# Altium schematic sheet SFP.schdoc: TEBF0808 - SFP
size A4; DocumentNumber: TEBF0808; Revision: 04; SheetNumber: 9; SheetTotal: 36; Date: 2016-09-29; CompanyName: Trenz Electronic GmbH; Organization: Trenz Electronic GmbH
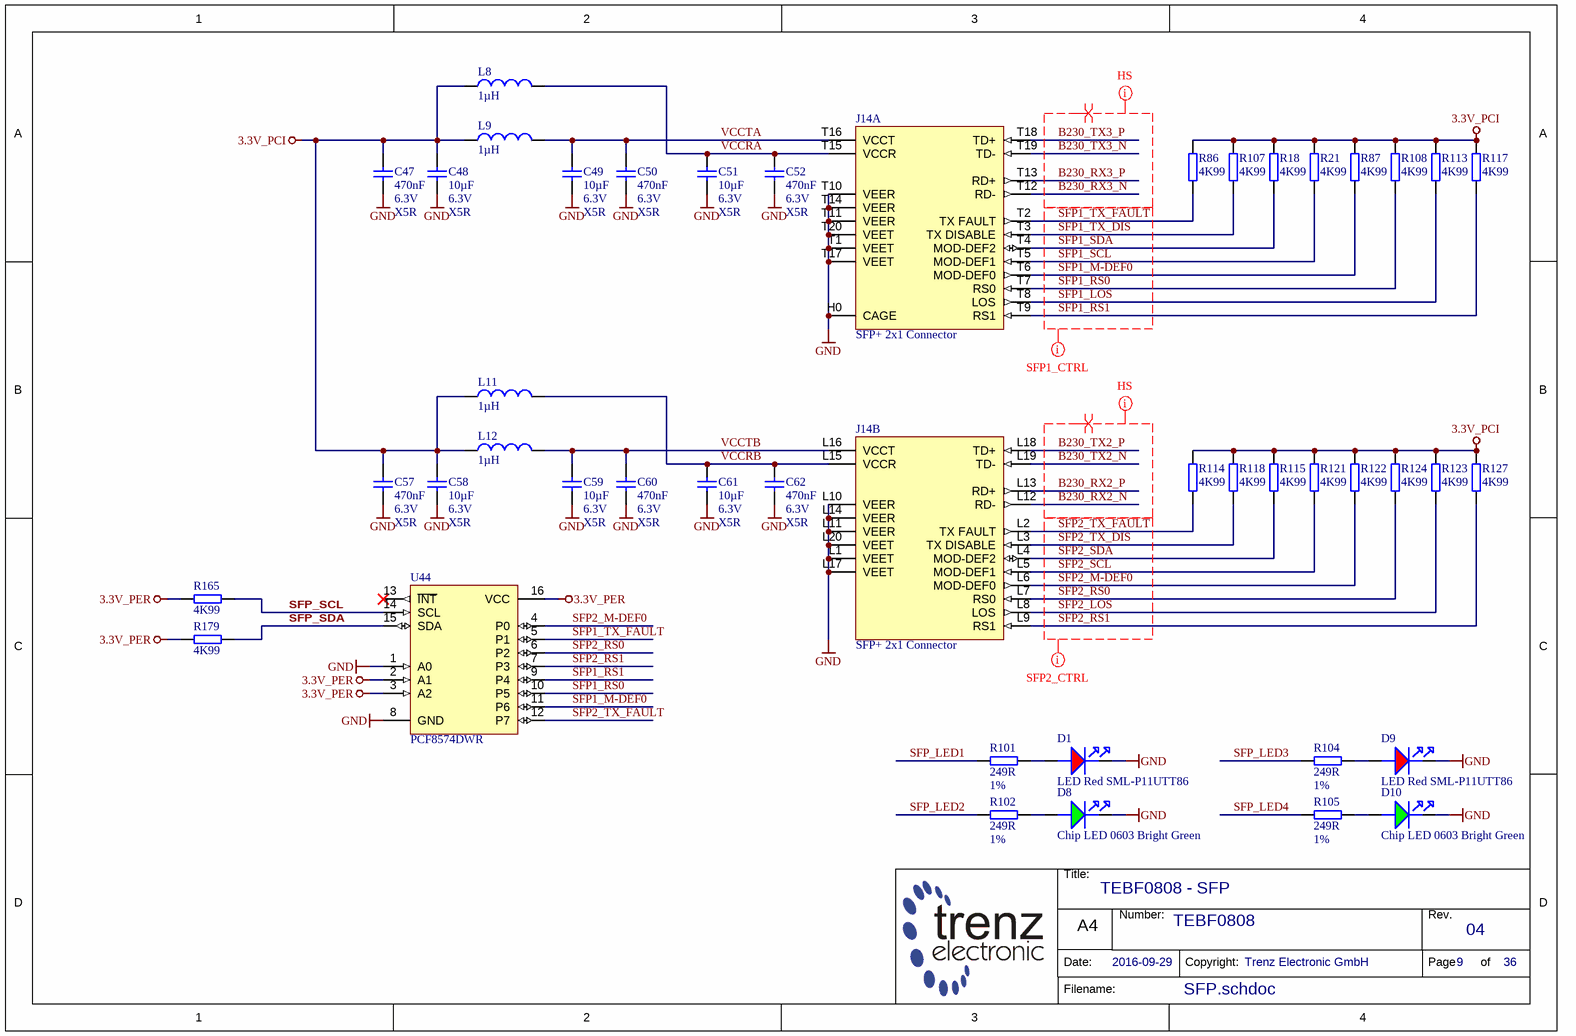
[diagram p0: SFP.schdoc]

## Parts
C47  470nF  Voltage: 6.3V  Technology: X5R  [CAPC1005X55N]
C48  10µF  Voltage: 6.3V  Technology: X5R  [CAPC1608X90N]
C49  10µF  Voltage: 6.3V  Technology: X5R  [CAPC1608X90N]
C50  470nF  Voltage: 6.3V  Technology: X5R  [CAPC1005X55N]
C51  10µF  Voltage: 6.3V  Technology: X5R  [CAPC1608X90N]
C52  470nF  Voltage: 6.3V  Technology: X5R  [CAPC1005X55N]
C57  470nF  Voltage: 6.3V  Technology: X5R  [CAPC1005X55N]
C58  10µF  Voltage: 6.3V  Technology: X5R  [CAPC1608X90N]
C59  10µF  Voltage: 6.3V  Technology: X5R  [CAPC1608X90N]
C60  470nF  Voltage: 6.3V  Technology: X5R  [CAPC1005X55N]
C61  10µF  Voltage: 6.3V  Technology: X5R  [CAPC1608X90N]
C62  470nF  Voltage: 6.3V  Technology: X5R  [CAPC1005X55N]
D1  LED Red SML-P11UTT86  [LEDC1006X25N_RED]
D8  Chip LED 0603 Bright Green  [chipLED_0603_Green]
D9  LED Red SML-P11UTT86  [LEDC1006X25N_RED]
D10  Chip LED 0603 Bright Green  [chipLED_0603_Green]
J14  SFP+ 2x1 Connector  [1-2007492-5]  (parts A,B of 2)
L8  1µH  [INDC2520X100N]
L9  1µH  [INDC2520X100N]
L11  1µH  [INDC2520X100N]
L12  1µH  [INDC2520X100N]
R18  4K99  [RESC1005X40N]
R21  4K99  [RESC1005X40N]
R86  4K99  [RESC1005X40N]
R87  4K99  [RESC1005X40N]
R101  249R  Tolerance: 1%  [RESC1005X40N]
R102  249R  Tolerance: 1%  [RESC1005X40N]
R104  249R  Tolerance: 1%  [RESC1005X40N]
R105  249R  Tolerance: 1%  [RESC1005X40N]
R107  4K99  [RESC1005X40N]
R108  4K99  [RESC1005X40N]
R113  4K99  [RESC1005X40N]
R114  4K99  [RESC1005X40N]
R115  4K99  [RESC1005X40N]
R117  4K99  [RESC1005X40N]
R118  4K99  [RESC1005X40N]
R121  4K99  [RESC1005X40N]
R122  4K99  [RESC1005X40N]
R123  4K99  [RESC1005X40N]
R124  4K99  [RESC1005X40N]
R127  4K99  [RESC1005X40N]
R165  4K99  [RESC1005X40N]
R179  4K99  [RESC1005X40N]
U44  PCF8574DWR  [SOIC127P1030X265-16N]

## Nets
3.3V_PCI: C47.1 C48.1 C57.1 C58.1 L8.1 L9.1 L11.1 L12.1 R18.2 R21.2 R86.2 R87.2 R107.2 R108.2 R113.2 R114.2 R115.2 R117.2 R118.2 R121.2 R122.2 R123.2 R124.2 R127.2
3.3V_PER: R165.1 R179.1 U44.2(A1) U44.3(A2) U44.16(VCC)
GND: C47.2 C48.2 C49.2 C50.2 C51.2 C52.2 C57.2 C58.2 C59.2 C60.2 C61.2 C62.2 D1.K D8.K D9.K D10.K J14.H0(CAGE) J14.L1(VEET) J14.L10(VEER) J14.L11(VEER) J14.L14(VEER) J14.L17(VEET) J14.L20(VEET) J14.T1(VEET) J14.T10(VEER) J14.T11(VEER) J14.T14(VEER) J14.T17(VEET) J14.T20(VEET) U44.1(A0) U44.8(GND)
B230_RX2_N: J14.L12(RD-)
B230_RX2_P: J14.L13(RD+)
B230_RX3_N: J14.T12(RD-)
B230_RX3_P: J14.T13(RD+)
B230_TX2_N: J14.L19(TD-)
B230_TX2_P: J14.L18(TD+)
B230_TX3_N: J14.T19(TD-)
B230_TX3_P: J14.T18(TD+)
SFP1_LOS: J14.T8(LOS) R113.1
SFP1_M-DEF0: J14.T6(MOD-DEF0) R87.1 U44.11(P6)
SFP1_RS0: J14.T7(RS0) R108.1 U44.10(P5)
SFP1_RS1: J14.T9(RS1) R117.1 U44.9(P4)
SFP1_SCL: J14.T5(MOD-DEF1) R21.1
SFP1_SDA: J14.T4(MOD-DEF2) R18.1
SFP1_TX_DIS: J14.T3(TX_DISABLE) R107.1
SFP1_TX_FAULT: J14.T2(TX_FAULT) R86.1 U44.5(P1)
SFP2_LOS: J14.L8(LOS) R123.1
SFP2_M-DEF0: J14.L6(MOD-DEF0) R122.1 U44.4(P0)
SFP2_RS0: J14.L7(RS0) R124.1 U44.6(P2)
SFP2_RS1: J14.L9(RS1) R127.1 U44.7(P3)
SFP2_SCL: J14.L5(MOD-DEF1) R121.1
SFP2_SDA: J14.L4(MOD-DEF2) R115.1
SFP2_TX_DIS: J14.L3(TX_DISABLE) R118.1
SFP2_TX_FAULT: J14.L2(TX_FAULT) R114.1 U44.12(P7)
SFP_LED1: R101.1
SFP_LED2: R102.1
SFP_LED3: R104.1
SFP_LED4: R105.1
SFP_SCL: R165.2 U44.14(SCL)
SFP_SDA: R179.2 U44.15(SDA)
VCCRA: C51.1 C52.1 J14.T15(VCCR) L8.2
VCCRB: C61.1 C62.1 J14.L15(VCCR) L11.2
VCCTA: C49.1 C50.1 J14.T16(VCCT) L9.2
VCCTB: C59.1 C60.1 J14.L16(VCCT) L12.2
NetD1_A: D1.A R101.2
NetD8_A: D8.A R102.2
NetD9_A: D9.A R104.2
NetD10_A: D10.A R105.2

Not connected (* = marked no-connect by the designer): U44 13(~{INT})*

## Layout directives
net class SFP1_CTRL: SFP1_LOS, SFP1_M-DEF0, SFP1_RS0, SFP1_RS1, SFP1_SCL, SFP1_SDA, SFP1_TX_DIS, SFP1_TX_FAULT
differential pair: B230_RX2_N, B230_RX2_P, B230_RX3_N, B230_RX3_P, B230_TX2_N, B230_TX2_P, B230_TX3_N, B230_TX3_P
net class SFP2_CTRL: SFP2_LOS, SFP2_M-DEF0, SFP2_RS0, SFP2_RS1, SFP2_SCL, SFP2_SDA, SFP2_TX_DIS, SFP2_TX_FAULT
net class HS: B230_RX2_N, B230_RX2_P, B230_RX3_N, B230_RX3_P, B230_TX2_N, B230_TX2_P, B230_TX3_N, B230_TX3_P

## Notes on the sheet
- Title:
- Number:
- Rev.
- Date:
- A4
- Copyright:
- Page
- of
- Filename:

## Library data of the parts
C47 C50 C52 C57 C60 C62 = 23659: KON 470nF 6,3V X5R SMD; AN: 23659; Mixed: SMT; Value: 470n; Preferred: Yes; Case: 1005 (0402)
C48 C49 C51 C58 C59 C61 = 22918: KON 10µF 6,3V X5R SMD; AN: 22918; Mixed: SMT; Value: 10u; Case: 1608 (0603)
D1 D9 = 24212: LED Rot SML-P11UTT86 SMD; AN: 24212; Mixed: SMT; Preferred: Yes; Case: 1005 (0402); HelpURL: B:\AD\adlib\datasheet\SML-P1; H-ART: SML-P11UTT86
D8 D10 = 25986: AN: 25986; Voltage: 2.0; Mixed: SMT; Preferred: Yes; H-ART: 150 060 VS7 500 0; Case: 0603; HelpURL: B:\AD\adlib\datasheet\WL_SMCW
J14 = 27231: SFP+ 2x1 Connector  Sp Fing 4LP EMI Enhanced; AN: 27231; Mixed: THT; Trenz-Stock: Yes; HelpURL: B:\AD\adlib\datasheet\1-2007492-5; H-ART: 1-2007492-5
L8 L9 L11 L12 = 25265: IND SMD 1µH +-20% 0.055Ohm; AN: 25265; Value: 1u; Trenz-Stock: Yes; Voltage: 1.7A; Mixed: SMT; H-ART: 74479787210a; Case: WE-PMI 2520(1008); HelpURL: B:\AD\adlib\datasheet\74479787210a; Technology: 0.055Ohm
R18 R21 R86 R87 R107 R108 R113-R115 R117 R118 R121-R124 R127 = 22754: WID SMD 4K99 1% 0,063W; AN: 22754; Mixed: SMT; Value: 4.99K; Preferred: Yes; Case: 1005 (0402); Tolerance: 1%; Technology: TK100
R101 R102 R104 R105 = 22740: WID SMD 249R 1% 0,063W; AN: 22740; Mixed: SMT; Value: 249; Preferred: Yes; Case: 1005 (0402); Technology: TK100
R165 R179 = 22754: WID SMD 4K99 1% 0,063W; AN: 22754; Value: 4.99K; Mixed: SMT; Preferred: Yes; Case: 1005 (0402); Tolerance: 1%; Technology: TK100
U44 = 26502: AN: 26502; Mixed: SMT; Case: SO16W DW; HelpURL: B:\AD\adlib\datasheet\PCF8574; H-ART: PCF8574DWR